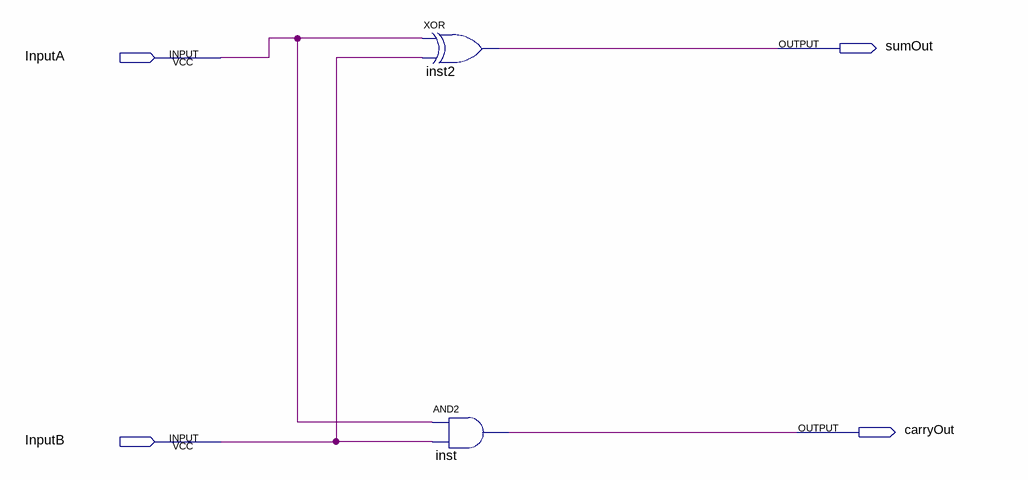
[diagram p0: schematic sheet]
// Quartus schematic HalfAdder.bdf as structural Verilog: 2 symbols, 4 pins
module HalfAdder (
  input  InputA,
  input  InputB,
  output sumOut,
  output carryOut
);

  xor inst2 (sumOut, InputA, InputB);
  and inst (carryOut, InputA, InputB);
endmodule
